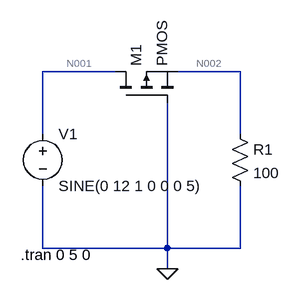
[diagram p0: schematic Draft1.asc]
Draft1.asc, the LTspice schematic file:
Version 4
SHEET 1 880 680
WIRE 112 16 0 16
WIRE 304 16 208 16
WIRE 0 112 0 16
WIRE 304 112 304 16
WIRE 0 288 0 192
WIRE 192 288 192 64
WIRE 192 288 0 288
WIRE 304 288 304 192
WIRE 304 288 192 288
WIRE 192 320 192 288
FLAG 192 320 0
SYMBOL voltage 0 96 R0
WINDOW 123 0 0 Left 0
WINDOW 39 0 0 Left 0
SYMATTR InstName V1
SYMATTR Value SINE(0 12 1 0 0 0 5)
SYMBOL res 288 96 R0
SYMATTR InstName R1
SYMATTR Value 100
SYMBOL pmos 112 64 R270
SYMATTR InstName M1
TEXT -34 298 Left 2 !.tran 0 5 0

The netlist it stands for:
* Draft1.asc
V1 N001 0 SINE(0 12 1 0 0 0 5)
R1 N002 0 100
M1 N001 0 N002 N002 PMOS
.model NMOS NMOS
.model PMOS PMOS
.lib standard.mos
.tran 0 5 0
.backanno
.end

* Results of the author's LTspice run, read from the files saved beside the schematic
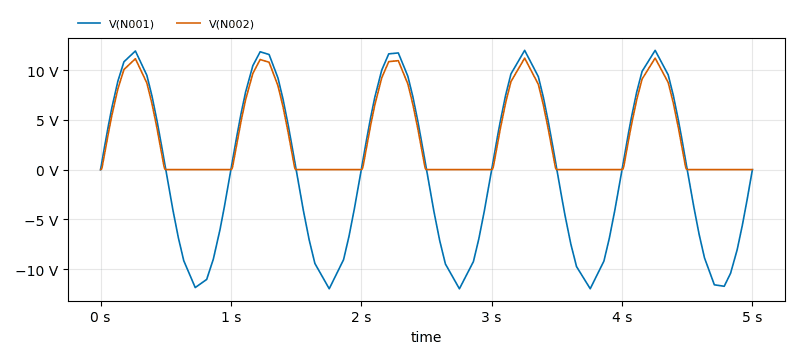
[diagram p1: Transient Analysis of Draft1.asc, plotted from the saved traces]
* Transient Analysis, 1 run:
*   V(N001): min -11.98 V, max 11.99 V, average 17.84 mV, rms 8.346 V, last 0 V
*   V(N002): min 0 V, max 11.21 V, average 3.384 V, rms 5.428 V, last 0 V